# EAGLE design Luminode_Panel_Mark_I (EAGLE 6.6.0)
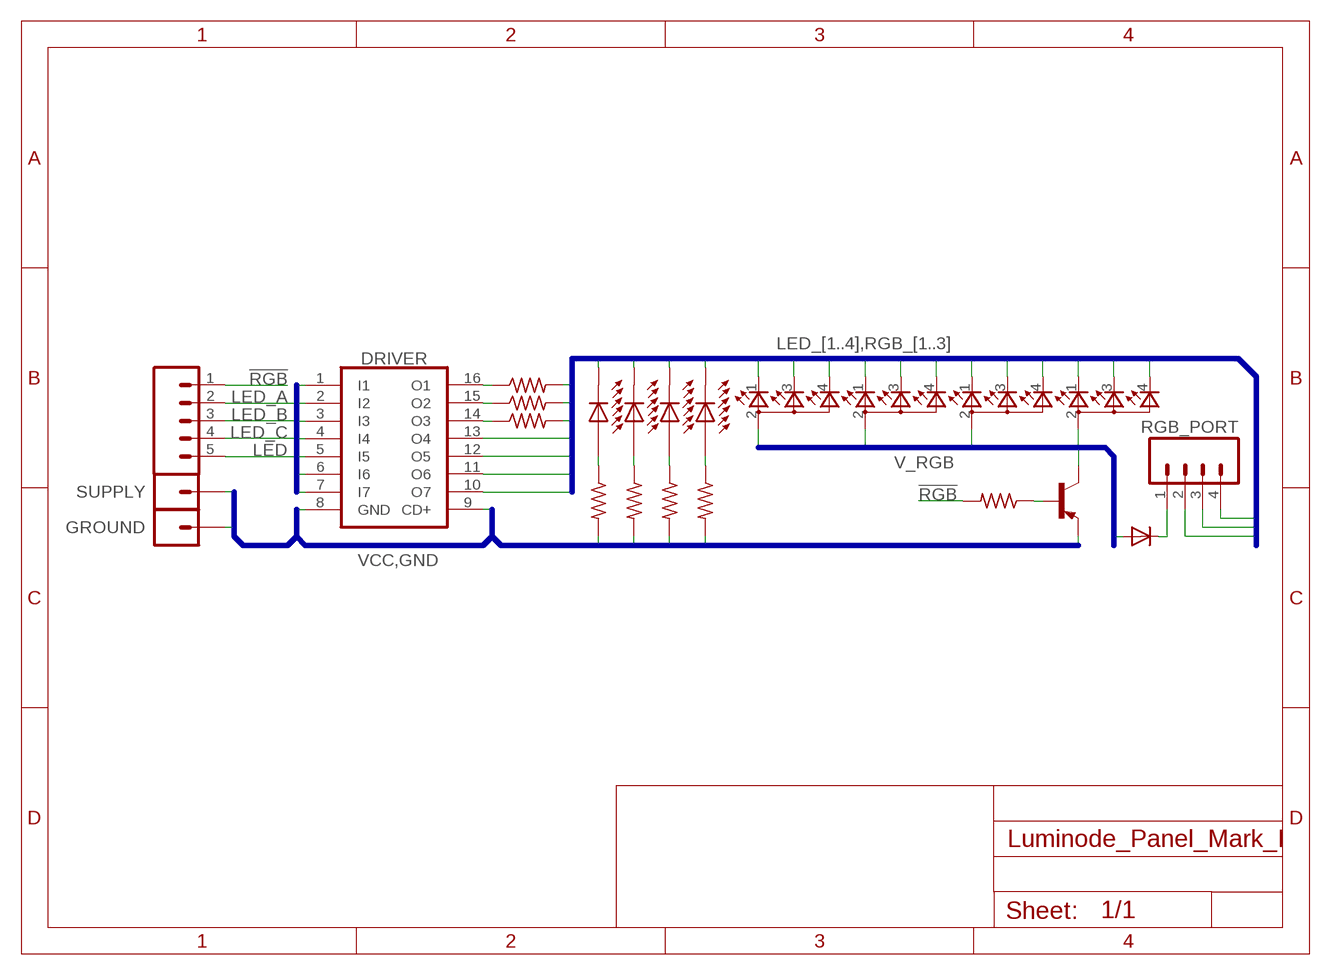
[diagram p0: schematic, sheet 1]

## Parts
DIODE  DIODE-DO-214AC  [DO-214AC]
DRIVER  ULN2003AD  [SO16]
GROUND  M01PTH  [1X01]
LED_1  LXHL-DB01  [SIDE-EMITTING]
LED_2  LXHL-DB01  [SIDE-EMITTING]
LED_3  LXHL-DB01  [SIDE-EMITTING]
LED_4  LXHL-DB01  [SIDE-EMITTING]
LED_RGB_1  TOPLED-3PLCC  [P-LCC-4-3]
LED_RGB_2  TOPLED-3PLCC  [P-LCC-4-3]
LED_RGB_3  TOPLED-3PLCC  [P-LCC-4-3]
LED_RGB_4  TOPLED-3PLCC  [P-LCC-4-3]
R_LED_1  100E  R-US_M1206  [M1206]
R_LED_2  100E  R-US_M1206  [M1206]
R_LED_3  100E  R-US_M1206  [M1206]
R_LED_4  100E  R-US_M1206  [M1206]
R_RGB  100E  R-US_M0805  [M0805]
R_RGB_A  100E  R-US_M0805  [M0805]
R_RGB_B  100E  R-US_M0805  [M0805]
R_RGB_C  100E  R-US_M0805  [M0805]
RGB_PORT  M04SMD  [1X04-SMD]
SIGNAL  M05PTH  [1X05]
SUPPLY  M01PTH  [1X01]
TRANSISTOR  BC807-16-PNP-SOT23-BEC  [SOT23-BEC]

## Nets
!RGB: R_RGB.2 SIGNAL.1
GND [SUPPLY]: DRIVER.8(GND) GROUND.1
LED: DRIVER.4(I4) DRIVER.5(I5) DRIVER.6(I6) DRIVER.7(I7) SIGNAL.5
LED_1: DRIVER.13(O4) LED_1.CATHODE(C)
LED_2: DRIVER.10(O7) LED_2.CATHODE(C)
LED_3: DRIVER.11(O6) LED_3.CATHODE(C)
LED_4: DRIVER.12(O5) LED_4.CATHODE(C)
LED_A: DRIVER.1(I1) SIGNAL.2
LED_B: DRIVER.2(I2) SIGNAL.3
LED_C: DRIVER.3(I3) SIGNAL.4
N$1: DRIVER.16(O1) R_RGB_A.1
N$2: DRIVER.15(O2) R_RGB_B.1
N$3: DRIVER.14(O3) R_RGB_C.1
N$4 [HIGH CURRENT]: LED_1.ANODE(A) R_LED_1.1
N$6 [HIGH CURRENT]: LED_2.ANODE(A) R_LED_2.1
N$7 [HIGH CURRENT]: LED_3.ANODE(A) R_LED_3.1
N$8 [HIGH CURRENT]: LED_4.ANODE(A) R_LED_4.1
N$9: R_RGB.1 TRANSISTOR.B
RGB_1: LED_RGB_1.1(CRED) LED_RGB_2.1(CRED) LED_RGB_3.1(CRED) LED_RGB_4.1(CRED) R_RGB_A.2 RGB_PORT.4
RGB_2: LED_RGB_1.3(CBLUE) LED_RGB_2.3(CBLUE) LED_RGB_3.3(CBLUE) LED_RGB_4.3(CBLUE) R_RGB_B.2 RGB_PORT.3
RGB_3: LED_RGB_1.4(CGREEN) LED_RGB_2.4(CGREEN) LED_RGB_3.4(CGREEN) LED_RGB_4.4(CGREEN) R_RGB_C.2 RGB_PORT.2
RGB_EXT [HIGH CURRENT]: DIODE.C RGB_PORT.1
V_RGB [HIGH CURRENT]: DIODE.A LED_RGB_1.2(A2) LED_RGB_2.2(A2) LED_RGB_3.2(A2) LED_RGB_4.2(A2) TRANSISTOR.C
VCC [SUPPLY]: DRIVER.9(CD+) R_LED_1.2 R_LED_2.2 R_LED_3.2 R_LED_4.2 SUPPLY.1 TRANSISTOR.E

## Buses
LED_[1..4],RGB_[1..3]
VCC,GND
V_RGB
LED,LED_A,LED_B,LED_C

## Library data of the parts
DIODE = diode:DIODE-: DIODE
DRIVER = uln-udn:ULN2003A: DRIVER ARRAY
GROUND SUPPLY = SparkFun:M01: Header 1 Standard 1-pin 0.1" header. Use with straight break away headers (SKU : PRT-00116), right angle break away headers (PRT-00553), swiss pins (PRT-00743), machine pins (PRT-00117), and female headers (PRT-00115).
LED_1-LED_4 = lumiled:LXHL-*: Luxeon 1-Watt LUMILED® RG. Leds Sources: http://www.luxeon.com ... DS25.pdf http://www.lumiledsfuture.com Created by artoky@elisanet.fi
LED_RGB_1-LED_RGB_4 = Spark:TOPLED-3: Cree CLVBA-FKA
R_LED_1-R_LED_4 R_RGB R_RGB_A R_RGB_B R_RGB_C = rcl:R-US_: RESISTOR, American symbol
RGB_PORT = SparkFun:M04: Header 4 Standard 4-pin 0.1" header. Use with straight break away headers (SKU : PRT-00116), right angle break away headers (PRT-00553), swiss pins (PRT-00743), machine pins (PRT-00117), and female headers (PRT-00115). Molex polarized connector foot print use with SKU : PRT-08231 with associated crimp pins and housings.
SIGNAL = SparkFun-Connectors:M05: Header 5 Standard 5-pin 0.1" header. Use with straight break away headers (SKU : PRT-00116), right angle break away headers (PRT-00553), swiss pins (PRT-00743), machine pins (PRT-00117), and female headers (PRT-00115). Molex polarized connector foot print use with SKU : PRT-08230 with associated crimp pins and housings.
TRANSISTOR = transistor:*-PNP-: PNP Transistror

## Net classes
0 default: width 0.508 mm, clearance 0.508 mm
1 HIGH CURRENT: width 0.61 mm, clearance 0.61 mm
3 SUPPLY: width 0.813 mm, drill 0.61 mm, clearance 0.61 mm

## Board
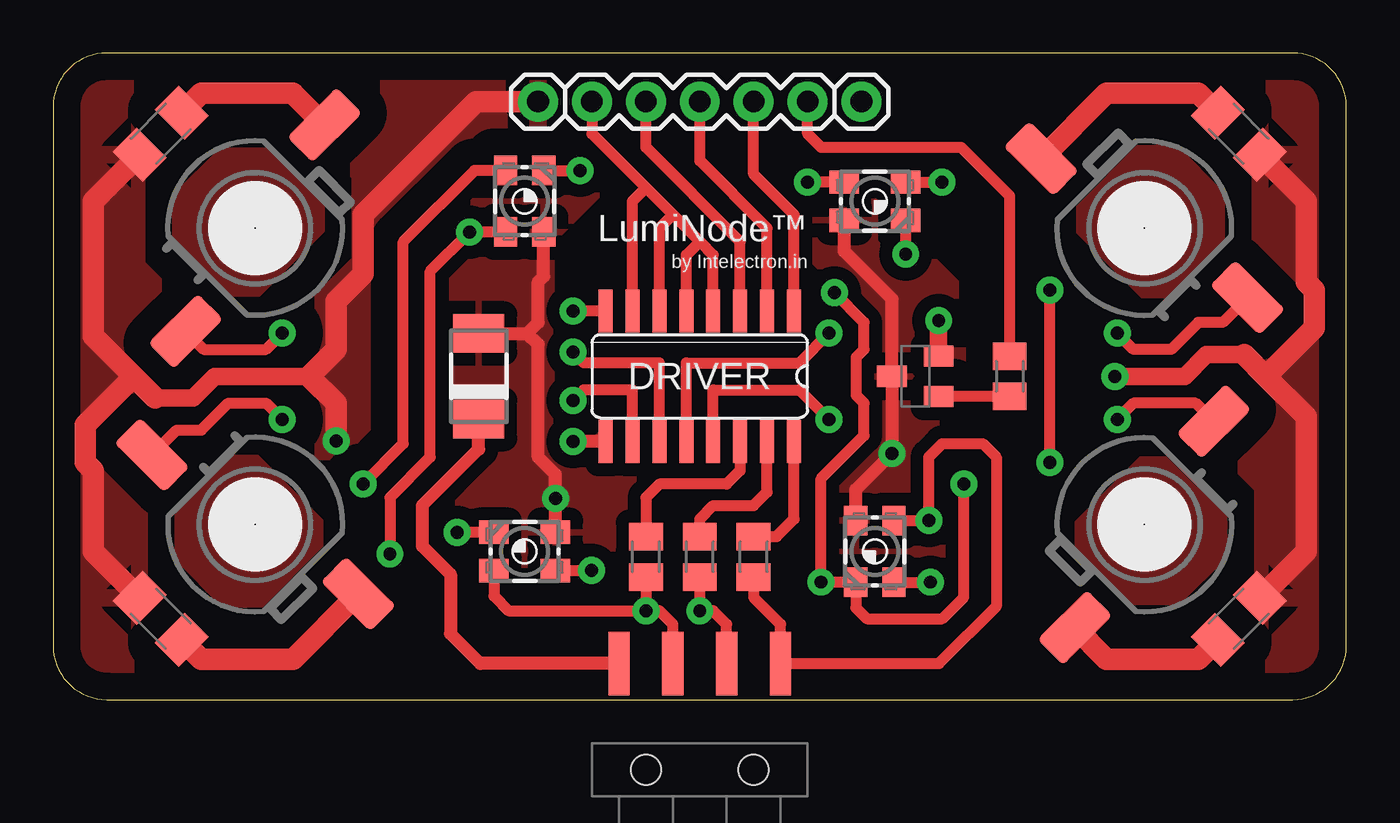
[diagram p1: board, top side]
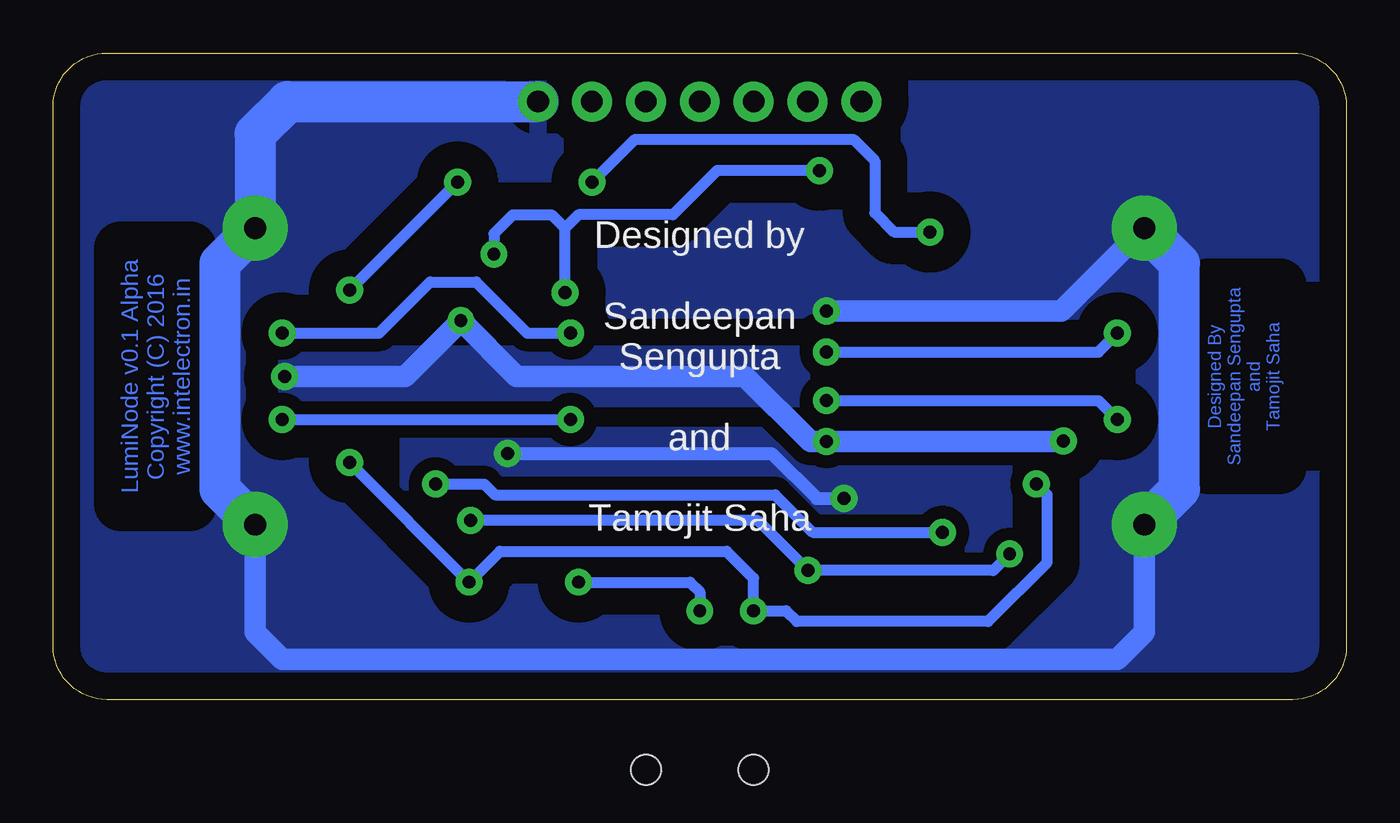
[diagram p2: board, bottom side, seen from below]

Size 60.96 x 30.48 mm. Coordinates in mm from the lower left corner, seen from the top.
Outline: 0,2.54 arc90 2.54,0 58.42,0 arc90 60.96,2.54 60.96,27.94 arc90 58.42,30.48 2.54,30.48 arc90 0,27.94 0,2.54
Copper layers (1*16): Top 0.035mm / dielectric 1.5mm / Bottom 0.035mm
Design rules "default *": minimum track width 10mil, minimum drill 24mil, track to track 8mil, track to pad 20mil, pad to pad 8mil, via to via 24mil, smd to smd 8mil, copper to edge 40mil, drill to drill 8mil, minimum pad ring 10mil, minimum via ring 8mil, stop-mask expansion 4mil, vias tented up to drill 0mil, thermal gap 24mil
vRestrict: area 47.4,18.2 to 55.5,26.3; area 47.4,4.2 to 55.5,12.3; area 5.5,4.2 to 13.6,12.3; area 5.5,18.2 to 13.6,26.3; area 45,0.2 to 51.1,6.4; area 51.8,10.2 to 57.9,16.3; area 3,14.2 to 9.1,20.3; area 9.9,24.1 to 16,30.2; area 43.4,22.6 to 49.5,28.7; area 53.3,15.7 to 59.4,21.8; area 11.4,1.8 to 17.5,7.9; area 1.5,8.6 to 7.6,14.7; 17 more areas

### Footprints (pad centres in the part's own frame; a part is rotated, then mirrored left to right if it is on the bottom)
DO-214AC = smd 1.8 x 2.4: A 2.025,0; C -2.025,0
SO16 = smd 0.66 x 2.032: 1 -4.445,-3.073; 2 -3.175,-3.073; 3 -1.905,-3.073; 4 -0.635,-3.073; 5 0.635,-3.073; 6 1.905,-3.073; 7 3.175,-3.073; 8 4.445,-3.073; 9 4.445,3.073; 10 3.175,3.073; 11 1.905,3.073; 12 0.635,3.073; 13 -0.635,3.073; 14 -1.905,3.073; 15 -3.175,3.073; 16 -4.445,3.073
1X01 = drill 1.016 pad 1.88: 1 0,0
SIDE-EMITTING = smd 3.3 x 1.7: ANODE -5.75,-1.125; CATHODE 5.75,1.125
P-LCC-4-3 = smd 1.1 x 1.4: 1 -0.9,-1.45; 2 0.9,-1.45; 3 0.9,1.45; 4 -0.9,1.45
M1206 = smd 1.6 x 2: 1 -1.4,0; 2 1.4,0
M0805 = smd 1.3 x 1.6: 1 -0.95,0; 2 0.95,0
1X04-SMD = smd 1 x 3: 1 -3.81,5; 2 -1.27,5; 3 1.27,5; 4 3.81,5 | hole 1.4: -2.54,0; 2.54,0
1X05 = drill 1.016 pad 1.88: 1 0,0; 2 2.54,0; 3 5.08,0; 4 7.62,0; 5 10.16,0
SOT23-BEC = smd 1 x 1.4: B -0.95,-1.1; C 0,1.1; E 0.95,-1.1

### Placement (x,y rotation side)
DIODE  20.07,15.24 90 top
DRIVER  30.48,15.24 180 top
GROUND  38.1,28.19 0 top
LED_1  51.44,8.26 45 top
LED_2  9.53,8.26 135 top
LED_3  9.53,22.23 225 top
LED_4  51.44,22.23 315 top
LED_RGB_1  38.73,6.99 180 top
LED_RGB_2  22.23,6.99 90 top
LED_RGB_3  22.23,23.5 0 top
LED_RGB_4  38.73,23.5 270 top
R_LED_1  55.88,3.81 45 top
R_LED_2  5.08,3.81 135 top
R_LED_3  5.08,26.67 225 top
R_LED_4  55.88,26.67 315 top
R_RGB  45.09,15.24 90 top
R_RGB_A  33.02,6.73 270 top
R_RGB_B  30.48,6.73 270 top
R_RGB_C  27.94,6.73 270 top
RGB_PORT  30.48,-3.3 0 top
SIGNAL  35.56,28.19 180 top
SUPPLY  22.86,28.19 180 top
TRANSISTOR  40.64,15.24 90 top

### Tracks (layer width: path | path; a pad name or v marks a point on that pad's centre or on a via)
!RGB
  Top 0.508: R_RGB.2 45.09,23.75 42.8,26.04 36.2,26.04 35.56,26.67 SIGNAL.1
GND  (via drill 0.61 pad 1.27, 1.02 pad 3.05)
  Top 0.508: DRIVER.8 v24.51,18.31
  Bottom 1.016: v51.44,8.26 51.44,3.17 50.16,1.91 10.79,1.91 9.53,3.17 v9.53,8.26 | v9.53,22.23 13.44,18.31 v24.51,18.31
  Bottom 1.93: v9.53,8.26 7.87,9.91 7.87,20.57 v9.53,22.23 | v51.44,8.26 53.09,9.91 53.09,20.57 v51.44,22.23 51.44,26.67 49.91,28.19 GROUND.1
  pour Bottom (isolate 1.27, rank 2): 60.96,27.94 arc90 58.42,30.48 2.54,30.48 arc90 0,27.94 0,2.54 arc90 2.54,0 58.42,0 arc90 60.96,2.54
  pour Top (isolate 0.635): 9.7,19.15 8.54,19.15 5.76,21.93 5.76,23.72 7.92,25.88 10.07,25.88 12.67,23.28 12.67,22.12
  pour Top (isolate 0.635): 51.26,11.33 52.42,11.33 55.2,8.55 55.2,6.76 53.04,4.6 50.89,4.6 48.29,7.2 48.29,8.36
  pour Top (isolate 0.635): 48.36,22.05 48.36,23.21 51.14,25.99 52.93,25.99 55.09,23.83 55.09,21.68 52.49,19.08 51.33,19.08
  pour Top (isolate 0.635): 12.6,8.43 12.6,7.27 9.82,4.49 8.03,4.49 5.87,6.65 5.87,8.8 8.47,11.4 9.63,11.4
LED
  Top 0.508: DRIVER.4 31.11,20.95 30.48,21.59 | SIGNAL.5 25.4,26.67 27.94,24.13 | 27.94,24.13 29.21,22.86 | 29.21,22.86 30.48,21.59 | DRIVER.5 29.84,20.95 30.48,21.59 | DRIVER.6 28.57,22.23 29.21,22.86 | DRIVER.7 27.3,23.5 27.94,24.13
LED_1  (via drill 0.61 pad 1.27)
  Top 0.508: 53.85,13.97 50.93,13.97 v50.16,13.21 | DRIVER.13 31.11,14.61 35.18,14.61 v36.58,13.21 | LED_1.CATHODE 53.85,13.97 | 53.85,13.97
  Bottom 0.508: v50.16,13.21 v36.58,13.21
LED_2  (via drill 0.61 pad 1.27)
  Top 0.508: LED_2.CATHODE 5.84,12.7 6.99,12.7 8.26,13.97 10.03,13.97 v10.79,13.21 | DRIVER.10 27.3,14.61 25.02,14.61 v24.51,14.1
  Bottom 0.508: v24.51,14.1 11.68,14.1 v10.79,13.21
LED_3  (via drill 0.61 pad 1.27)
  Top 0.508: DRIVER.11 28.57,15.88 25.02,15.88 v24.51,16.38 | LED_3.CATHODE 7.11,16.51 10.03,16.51 v10.79,17.27
  Bottom 0.508: v24.51,16.38 11.68,16.38 v10.79,17.27
LED_4  (via drill 0.61 pad 1.27)
  Top 0.508: LED_4.CATHODE 55.12,17.78 53.98,17.78 52.7,16.51 50.93,16.51 v50.16,17.27 | DRIVER.12 29.84,15.88 35.18,15.88 v36.58,17.27
  Bottom 0.508: v50.16,17.27 45.59,17.27 43.18,19.68 41.02,19.68 38.61,17.27 v36.58,17.27
LED_A
  Top 0.508: DRIVER.1 34.92,22.86 33.02,24.77 SIGNAL.2
LED_B
  Top 0.508: DRIVER.2 33.66,22.23 30.48,25.4 SIGNAL.3
LED_C
  Top 0.508: DRIVER.3 32.38,21.59 27.94,26.04 SIGNAL.4
N$1
  Top 0.508: R_RGB_A.1 34.1,7.68 34.92,8.51 DRIVER.16
N$2
  Top 0.508: R_RGB_B.1 30.48,8.51 31.11,9.14 33.02,9.14 33.66,9.78 DRIVER.15
N$3
  Top 0.508: DRIVER.14 32.38,10.79 31.75,10.16 28.57,10.16 27.94,9.53 R_RGB_C.1
N$4
  Top 1.016: R_LED_1.1 53.98,1.91 49.65,1.91 LED_1.ANODE
N$6
  Top 1.016: LED_2.ANODE 11.31,1.91 6.99,1.91 R_LED_2.1
N$7
  Top 1.016: R_LED_3.1 6.99,28.57 11.31,28.57 | 11.31,28.57 | LED_3.ANODE 11.43,28.45 11.31,28.57
N$8
  Top 1.016: 53.98,28.57 | LED_4.ANODE 49.65,28.57 53.98,28.57 | R_LED_4.1 53.98,28.57
N$9
  Top 0.508: R_RGB.1 TRANSISTOR.B
RGB_1  (via drill 0.61 pad 1.27)
  Top 0.508: LED_RGB_1.1 v41.27,8.44 41.27,11.43 41.91,12.06 43.81,12.06 44.45,11.43 44.45,4.39 41.76,1.7 RGB_PORT.4 34.29,3.56 33.02,4.83 R_RGB_A.2 | LED_RGB_4.1 v35.55,24.39 | LED_RGB_3.1 v19.63,22.05 17.78,20.19 17.78,11.43 15.88,9.53 v15.88,6.86 | LED_RGB_2.1 v25.39,6.08
  Bottom 0.508: v41.27,8.44 27.74,8.44 v25.39,6.08 16.65,6.08 v15.88,6.86 | v35.55,24.39 33.53,26.42 23.24,26.42 22.23,25.4 22.23,22.95 LED_RGB_3.1 v19.63,22.05
RGB_2  (via drill 0.61 pad 1.27)
  Top 0.508: R_RGB_B.2 v30.48,4.19 31.11,4.19 31.75,3.56 RGB_PORT.3 | LED_RGB_4.3 v40.19,21.01 | LED_RGB_3.3 v24.84,24.95 | LED_RGB_2.3 v19.04,7.88 | v36.83,19.18 38.23,17.78 38.23,16.51 37.85,16.13 37.85,14.35 38.23,13.97 38.23,12.45 36.2,10.41 v36.2,5.54 LED_RGB_1.3 37.84,4.33 38.35,3.81 41.91,3.81 42.93,4.83 v42.93,10.16
  Bottom 0.508: v36.2,5.54 30.93,5.54 30.48,5.08 v30.48,4.19 | v24.84,24.95 29.66,24.95 31.75,22.86 36.2,22.86 36.83,22.23 | v40.19,21.01 40.19,21.96 39.28,22.86 37.47,22.86 36.83,22.23 | v42.93,10.16 40.64,10.16 40.13,9.65 26.92,9.65 25.16,7.88 v19.04,7.88 | v36.83,19.18 36.83,22.23
RGB_3  (via drill 0.61 pad 1.27)
  Top 0.508: R_RGB_C.2 v27.94,4.19 | LED_RGB_2.4 20.77,4.88 21.46,4.19 v27.94,4.19 | LED_RGB_4.4 v41.9,24.39 | v46.99,11.18 v46.99,19.3 | LED_RGB_1.4 v41.35,5.54 | LED_RGB_3.4 19.86,24.95 16.51,21.59 16.51,12.06 v14.61,10.16 | RGB_PORT.2 29.21,3.56 28.57,4.19 v27.94,4.19
  Bottom 0.508: v46.99,11.18 v41.35,5.54 39.9,6.99 29.21,6.99 27.94,5.71 v27.94,4.19 26.42,4.19 25.91,3.68 16.89,3.68 14.1,6.48 14.1,9.65 v14.61,10.16 | v46.99,19.3 v41.9,24.39
RGB_EXT
  Top 0.61: DIODE.C 20.07,11.81 17.4,9.14 17.4,7.24 18.73,5.91 18.73,3.1 20.14,1.7 RGB_PORT.1
V_RGB  (via drill 0.61 pad 1.27)
  Top 0.61: LED_RGB_1.2 37.84,9.89 v39.54,11.6 TRANSISTOR.C 39.54,18.88 37.28,21.14 LED_RGB_4.2 | LED_RGB_3.2 23.12,19.95 22.86,19.68 22.86,17.78 22.34,17.27 | LED_RGB_2.2 v23.68,9.47 23.68,10.62 22.86,11.43 22.86,16.75 22.34,17.27 | DIODE.A 22.34,17.27
  Bottom 0.61: v39.54,11.6 27.09,11.6 24.97,9.47 v23.68,9.47
  pour Top: 26.04,25.4 25.4,26.04 22.23,26.04 22.23,23.5 20.32,23.5 19.05,23.5 18.41,22.86 18.41,10.79 19.68,9.53 21.59,9.53 22.23,8.89 22.23,6.99 24.77,6.99 25.4,7.62 25.4,9.53 24.13,10.79 23.5,11.43 23.5,20.95 23.5,21.59 25.4,23.5 26.04,24.13
  pour Top: 34.92,5.08 35.56,4.45 38.73,4.45 38.73,6.99 40.64,6.99 41.91,6.99 42.55,7.62 42.55,19.68 41.27,20.95 39.37,20.95 38.73,21.59 38.73,23.5 36.2,23.5 35.56,22.86 35.56,20.95 36.83,19.68 37.47,19.05 37.47,9.53 37.47,8.89 35.56,6.99 34.92,6.35
  pour Top: 15.88,12.7 44.45,12.7 44.45,6.35 15.88,6.35
  pour Bottom: 15.88,12.7 44.45,12.7 44.45,6.35 15.88,6.35
VCC  (via drill 0.61 pad 1.27)
  Top 0.61: DRIVER.9 v24.51,12.17
  Top 0.813: 56.13,16.26 54.36,16.26 53.34,15.24 v50.04,15.24 | 4.83,14.22 6.6,14.22 7.62,15.24 12.06,15.24 | TRANSISTOR.E v41.74,17.86 | 3.81,5.08 R_LED_2.2 | 3.81,5.08
  Top 1.016: R_LED_1.2 59.05,6.99 59.05,13.34 57.15,15.24 | 59.05,23.5 59.05,19.68 59.44,19.3 59.44,17.53 57.15,15.24 | 59.05,23.5 | 3.81,5.08 1.91,6.99 1.91,10.79 1.52,11.18 1.52,12.95 3.81,15.24 | 3.81,15.24 1.91,17.14 1.91,23.5 R_LED_3.2 | 57.15,15.24 56.13,16.26 | 4.83,14.22 3.81,15.24 | SUPPLY.1 19.94,28.19 14.61,22.86 14.61,20.07 13.34,18.8 13.34,16.51 12.06,15.24 13.34,13.97 v13.34,12.19 | R_LED_4.2 59.05,23.5 | 59.05,23.5
  Bottom 0.813: 13.36,12.17 v13.34,12.19
  Bottom 1.016: v50.04,15.24 44.36,15.24 v41.74,17.86 39.12,15.24 28.35,15.24 25.27,12.17 v24.51,12.17 13.36,12.17
  pour Top (isolate 1.27, rank 2): 60.96,27.94 arc90 58.42,30.48 2.54,30.48 arc90 0,27.94 0,2.54 arc90 2.54,0 58.42,0 arc90 60.96,2.54
  pour Bottom: 50.16,13.97 10.79,13.97 10.79,16.51 50.16,16.51

### Text on the board
Bottom: Designed By / Sandeepan Sengupta / and / Tamojit Saha | LumiNode v0.1 Alpha / Copyright (C) 2016 / www.intelectron.in
_tsilk: LumiNode™ | by Intelectron.in
_bsilk: Designed by / / Sandeepan / Sengupta / / and / / Tamojit Saha